# Altium schematic sheet Main.SchDoc: Main
size A3; Date: 17/09/18; Author: Pablo Sánchez Bergasa; Revision: 2.A.1; SheetNumber: 2; SheetTotal: 5; DocumentName: Main
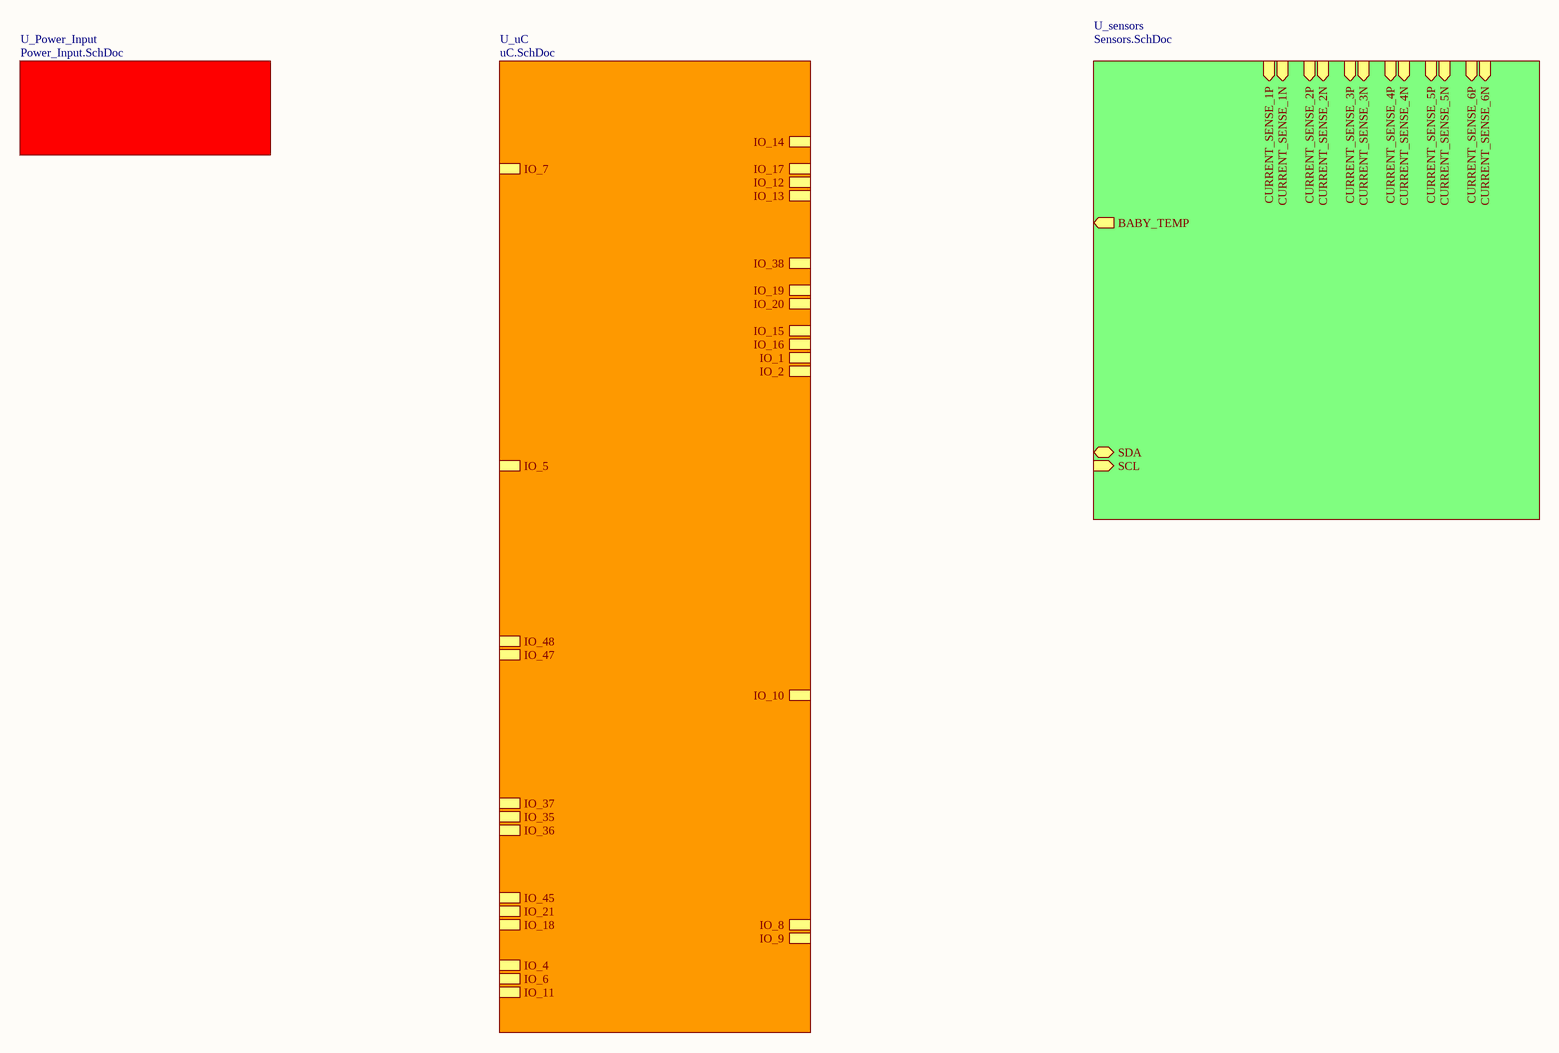
[diagram p0: Main.SchDoc]

## Sub-sheets
U_Power_Input = Power_Input.SchDoc: no entries
U_sensors = Sensors.SchDoc: BABY_TEMP (out), CURRENT_SENSE_1N (in), CURRENT_SENSE_3N (in), CURRENT_SENSE_2N (in), CURRENT_SENSE_1P (in), CURRENT_SENSE_3P (in), CURRENT_SENSE_2P (in), SCL (in), SDA (bidir), CURRENT_SENSE_6P (in), CURRENT_SENSE_5N (in), CURRENT_SENSE_4P (in), CURRENT_SENSE_4N (in), CURRENT_SENSE_6N (in), CURRENT_SENSE_5P (in)
U_uC = uC.SchDoc: IO_5, IO_35, IO_37, IO_36, IO_8, IO_9, IO_7, IO_21, IO_45, IO_15, IO_18, IO_17, IO_48, IO_47, IO_10, IO_14, IO_19, IO_20, IO_38, IO_13, IO_12, IO_16, IO_11, IO_4, IO_6, IO_2, IO_1

## Notes on the sheet
- Title
- Size:
- Date:
- A3
- Author:
- Time:
- Revision:
- Sheet
- of
- File: